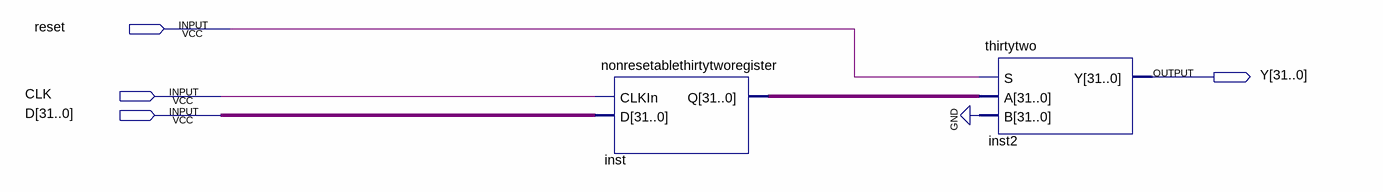
[diagram p0: schematic sheet]
// Quartus schematic newregi.bdf as structural Verilog: 2 symbols, 4 pins
module newregi (
  input  reset,
  input  CLK,
  input  [31:0] D,
  output [31:0] Y
);

  wire [31:0] inst_q;

  nonresetablethirtytworegister inst (.CLKIn(CLK), .D(D), .Q(inst_q));
  thirtytwo inst2 (.S(reset), .A(inst_q), .B({32{1'b0}}), .Y(Y));
endmodule
